# EAGLE design hddj (EAGLE 4.16)
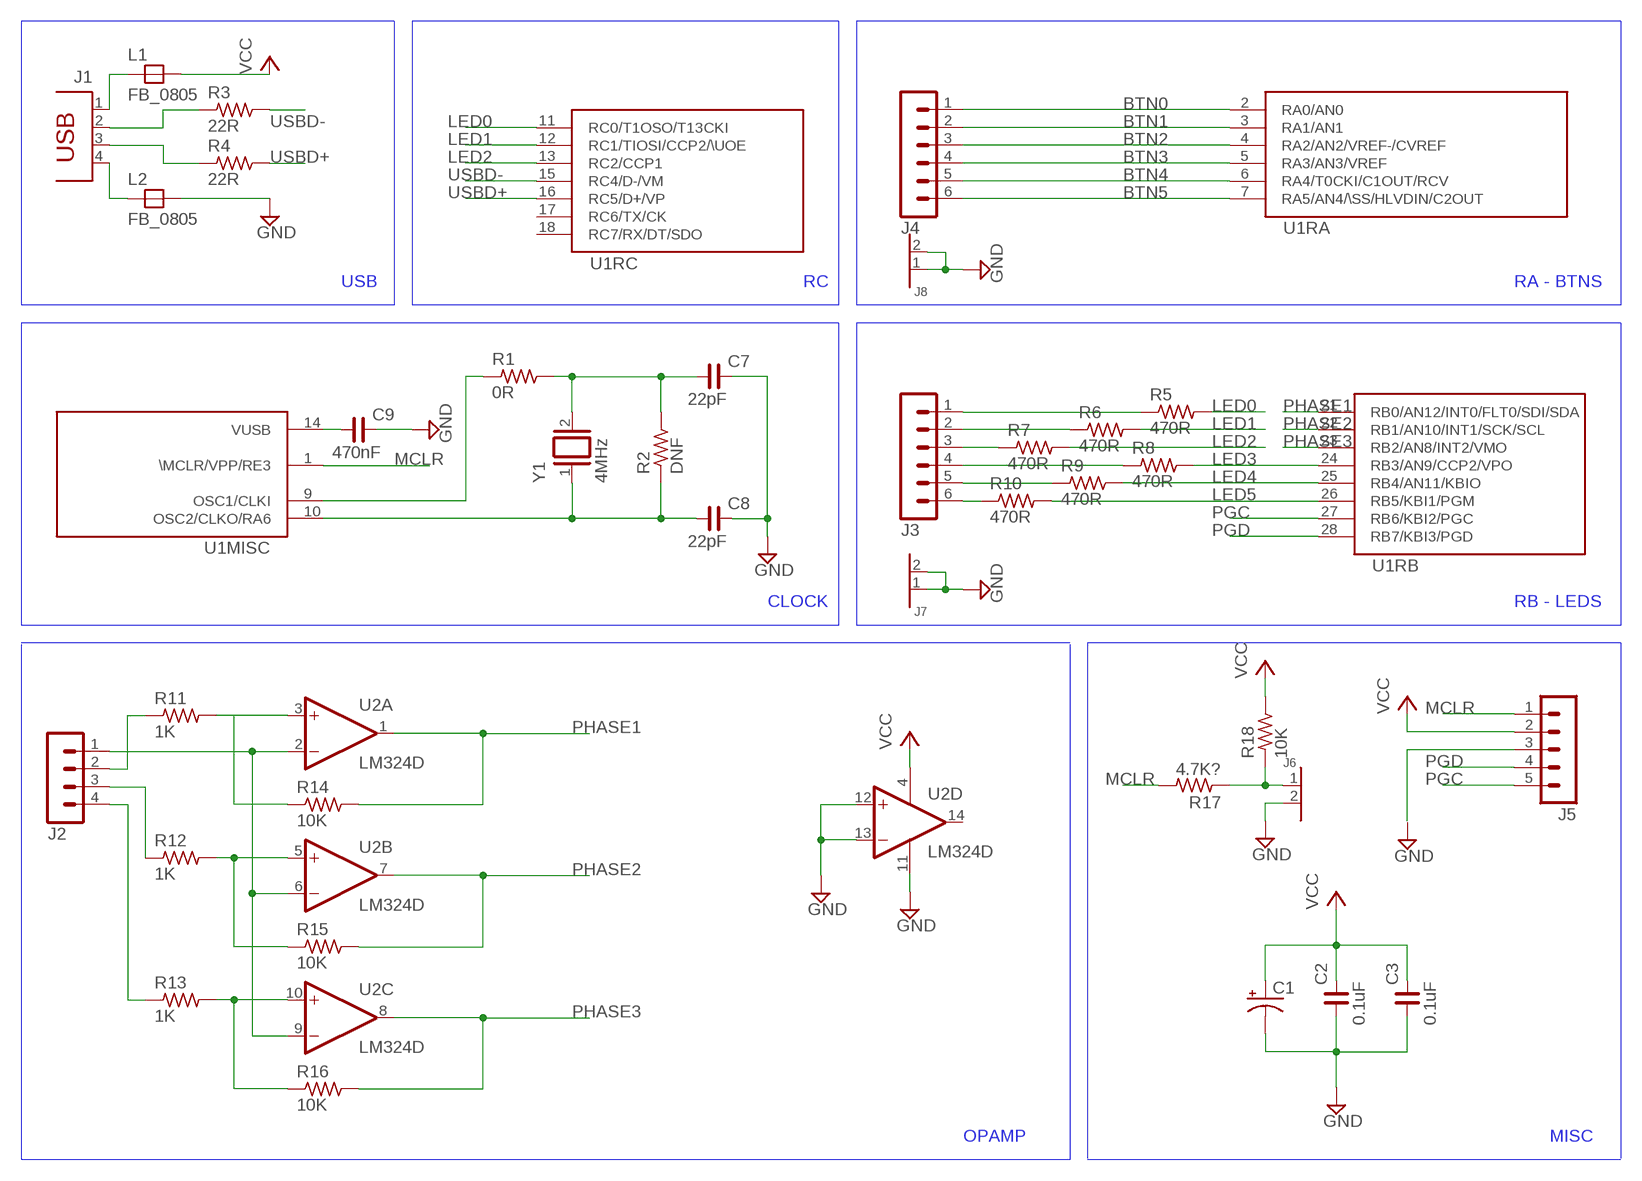
[diagram p0: schematic, sheet 1]

## Parts
C1  CPOL-USCT3216  [CT3216]
C2  0.1uF  C_0805  [C0805]
C3  0.1uF  C_0805  [C0805]
C7  22pF  C_0805  [C0805]
C8  22pF  C_0805  [C0805]
C9  470nF  C_0805  [C0805]
J1  PN61729  [PN61729]
J2  MA04-1  [MA04-1]
J3  MA06-1  [MA06-1]
J4  MA06-1  [MA06-1]
J5  MA05-1  [MA05-1]
J6  PINHDR2  [1X02]
J7  PINHDR2  [1X02]
J8  PINHDR2  [1X02]
L1  FB_0805  [L0805]
L2  FB_0805  [L0805]
R1  0R  R_0805  [R0805]
R2  DNF  R_0805  [R0805]
R3  22R  R_0805  [R0805]
R4  22R  R_0805  [R0805]
R5  470R  R_0805  [R0805]
R6  470R  R_0805  [R0805]
R7  470R  R_0805  [R0805]
R8  470R  R_0805  [R0805]
R9  470R  R_0805  [R0805]
R10  470R  R_0805  [R0805]
R11  1K  R_0805  [R0805]
R12  1K  R_0805  [R0805]
R13  1K  R_0805  [R0805]
R14  10K  R_0805  [R0805]
R15  10K  R_0805  [R0805]
R16  10K  R_0805  [R0805]
R17  4.7K?  R_0805  [R0805]
R18  10K  R_0805  [R0805]
U1  PIC18F2550SO  [SO-28W]
U2  LM324D  [SO14]
Y1  4MHz  XTAL/S  [QS]

## Nets
BTN0: J4.1 U1.2(RA:RA0/AN0)
BTN1: J4.2 U1.3(RA:RA1/AN1)
BTN2: J4.3 U1.4(RA:RA2/AN2/VREF-/CVREF)
BTN3: J4.4 U1.5(RA:RA3/AN3/VREF)
BTN4: J4.5 U1.6(RA:RA4/T0CKI/C1OUT/RCV)
BTN5: J4.6 U1.7(RA:RA5/AN4/\SS/HLVDIN/C2OUT)
GND: C1.- C2.1 C3.1 C7.2 C8.2 C9.2 J5.3 J6.2 J7.1 J7.2 J8.1 J8.2 L2.2 U2.11(P:V-) U2.12(D:+IN) U2.13(D:-IN)
LED0: R5.2 U1.11(RC:RC0/T1OSO/T13CKI)
LED1: R6.2 U1.12(RC:RC1/TIOSI/CCP2/\UOE)
LED2: R7.2 U1.13(RC:RC2/CCP1)
LED3: R8.2 U1.24(RB:RB3/AN9/CCP2/VPO)
LED4: R9.2 U1.25(RB:RB4/AN11/KBIO)
LED5: R10.2 U1.26(RB:RB5/KBI1/PGM)
MCLR: J5.1 R17.2 U1.1(MISC:\MCLR/VPP/RE3)
N$1: J3.6 R10.1
N$2: R1.1 U1.9(MISC:OSC1/CLKI)
N$3: J3.5 R9.1
N$4: J3.4 R8.1
N$5: J3.3 R7.1
N$6: J3.2 R6.1
N$7: J3.1 R5.1
N$8: J6.1 R17.1 R18.1
N$11: R13.2 R16.1 U2.10(C:+IN)
N$12: R12.2 R15.1 U2.5(B:+IN)
N$13: R11.2 R14.1 U2.3(A:+IN)
N$14: C7.1 R1.2 R2.2 Y1.2
N$15: C8.1 R2.1 U1.10(MISC:OSC2/CLKO/RA6) Y1.1
N$16: C9.1 U1.14(MISC:VUSB)
N$17: J2.1 U2.2(A:-IN) U2.6(B:-IN) U2.9(C:-IN)
N$18: J1.4 L2.1
N$19: J2.2 R11.1
N$20: J2.3 R12.1
N$21: J2.4 R13.1
N$22: J1.3 R4.1
N$29: J1.2 R3.1
N$30: J1.1 L1.1
PGC: J5.5 U1.27(RB:RB6/KBI2/PGC)
PGD: J5.4 U1.28(RB:RB7/KBI3/PGD)
PHASE1: R14.2 U1.21(RB:RB0/AN12/INT0/FLT0/SDI/SDA) U2.1(A:OUT)
PHASE2: R15.2 U1.22(RB:RB1/AN10/INT1/SCK/SCL) U2.7(B:OUT)
PHASE3: R16.2 U1.23(RB:RB2/AN8/INT2/VMO) U2.8(C:OUT)
USBD+: R4.2 U1.16(RC:RC5/D+/VP)
USBD-: R3.2 U1.15(RC:RC4/D-/VM)
VCC: C1.+ C2.2 C3.2 J5.2 L1.2 R18.2 U2.4(P:V+)
Unconnected: U1.17(RC:RC6/TX/CK) U1.18(RC:RC7/RX/DT/SDO) U2.14(D:OUT)

## Notes on the sheet
- USB | RC | RA - BTNS
- CLOCK | RB - LEDS
- OPAMP | MISC

## Power pins joined to a net without a drawn wire
GND: U1.8(GND) U1.19(GND)
VCC: U1.20(VCC)

## Library data of the parts
C1 = rcl:CPOL-US: POLARIZED CAPACITOR, American symbol
C2 C3 C7-C9 = rc-master:C_: NON-POLARIZED CAP
J1 = con-berg:PN61729: BERG USB connector
J2 = con-lstb:MA04-1: PIN HEADER
J3 J4 = con-lstb:MA06-1: PIN HEADER
J5 = con-lstb:MA05-1: PIN HEADER
J6-J8 = dongle:PINHDR2
L1 L2 = rc-master:FB_: FERRITE BEAD
R1-R18 = rc-master:R_: RESISTOR
U1 = dongle:PIC18F2550
U2 = linear:LM324: OP AMP
Y1 = special:XTAL/S: CRYSTAL

## Board
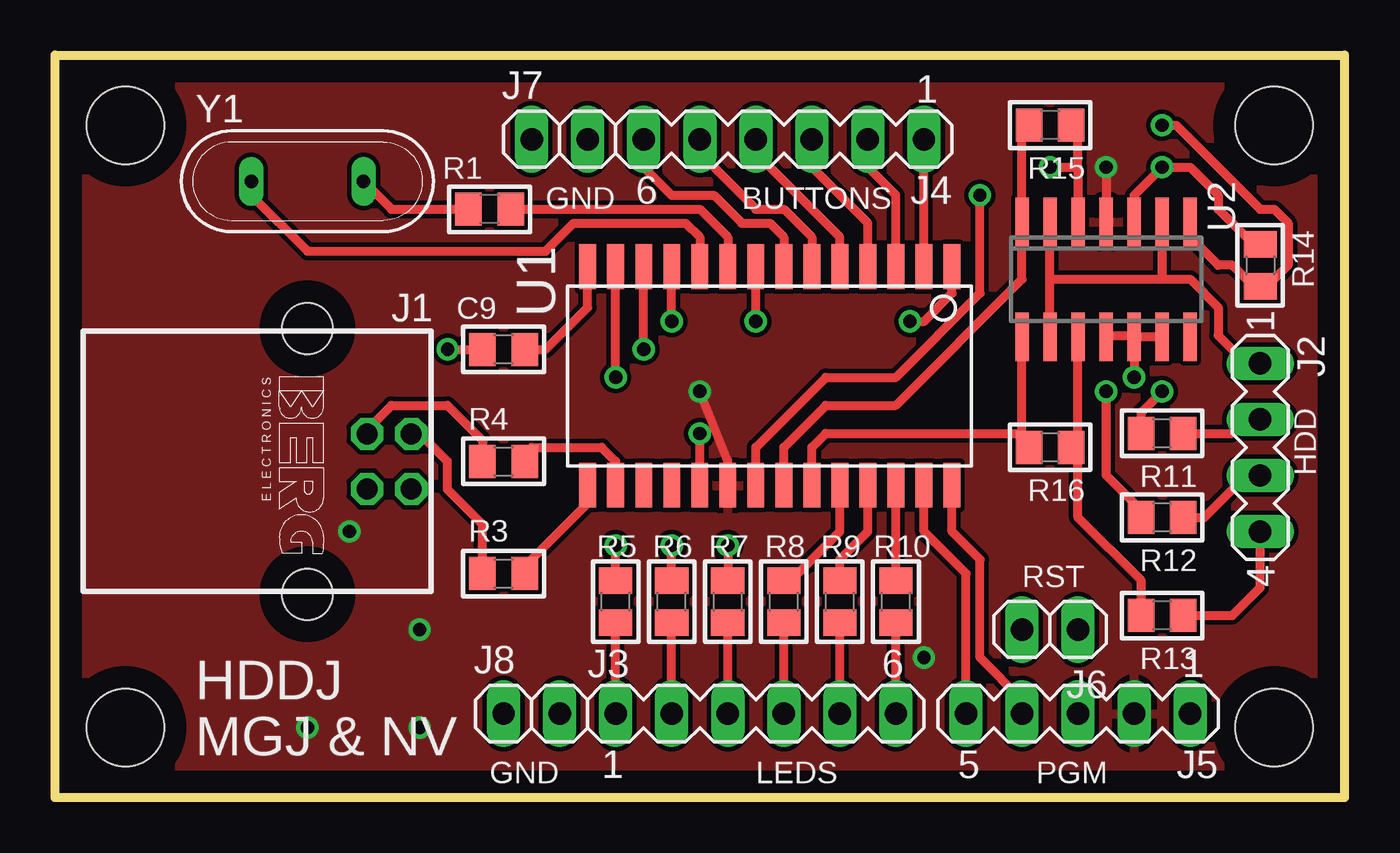
[diagram p1: board, top side]
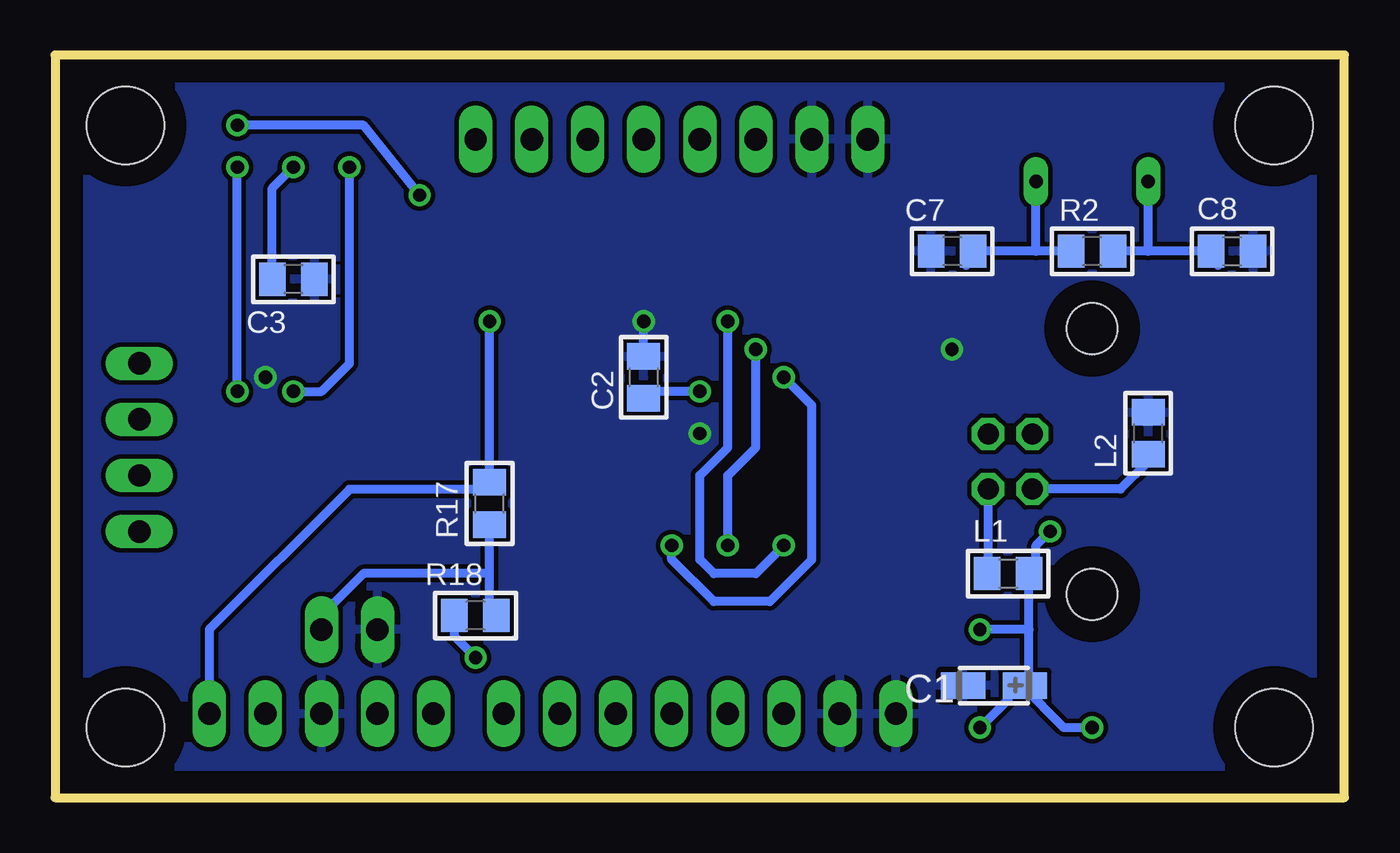
[diagram p2: board, bottom side, seen from below]

Size 58.42 x 33.66 mm. Coordinates in mm from the lower left corner, seen from the top.
Outline: 0,0 0,33.66 58.42,33.66 58.42,0 0,0
Copper layers (1*16): Top 0.035mm / dielectric 1.5mm / Bottom 0.035mm
Design rules "default": minimum track width 10mil, minimum drill 12mil, track to track 8mil, track to pad 8mil, pad to pad 8mil, via to via 8mil, smd to smd 8mil, copper to edge 40mil, drill to drill 8mil, minimum pad ring 10mil, minimum via ring 8mil, stop-mask expansion 4mil, vias tented up to drill 0mil, thermal gap 10mil
Holes 3.5 mm at 3.17,3.17 3.17,30.48 55.24,30.48 55.24,3.17

### Footprints (pad centres in the part's own frame; a part is rotated, then mirrored left to right if it is on the bottom)
CT3216 = smd 2 x 1.2: + 1.4,0; - -1.4,0
C0805 = smd 1.2 x 1.5: 1 -0.953,0; 2 0.953,0
PN61729 = drill 0.95 octagon: 1 1.25,4.71; 2 -1.25,4.71; 3 -1.25,2.71; 4 1.25,2.71 | hole 2.3: -6.02,0; 6.02,0
MA04-1 = drill 1.016 long: 1 -3.81,0; 2 -1.27,0; 3 1.27,0; 4 3.81,0
MA06-1 = drill 1.016 long: 1 -6.35,0; 2 -3.81,0; 3 -1.27,0; 4 1.27,0; 5 3.81,0; 6 6.35,0
MA05-1 = drill 1.016 long: 1 -5.08,0; 2 -2.54,0; 3 0,0; 4 2.54,0; 5 5.08,0
1X02 = drill 1.016 long: 1 -1.27,0; 2 1.27,0
L0805 = smd 1.2 x 1.5: 1 -0.953,0; 2 0.953,0
R0805 = smd 1.2 x 1.5: 1 -0.953,0; 2 0.953,0
SO-28W = smd 0.762 x 2.032: 1 -7.62,-5.016; 2 -6.35,-5.016; 3 -5.08,-5.016; 4 -3.81,-5.016; 5 -2.54,-5.016; 6 -1.27,-5.016; 7 0,-5.016; 8 1.27,-5.016; 9 2.54,-5.016; 10 3.81,-5.016; 11 5.08,-5.016; 12 6.35,-5.016; 13 7.62,-5.016; 14 8.89,-5.016; 15 8.89,4.889; 16 7.62,4.889; 17 6.35,4.889; 18 5.08,4.889; 19 3.81,4.889; 20 2.54,4.889; 21 1.27,4.889; 22 0,4.889; 23 -1.27,4.889; 24 -2.54,4.889; 25 -3.81,4.889; 26 -5.08,4.889; 27 -6.35,4.889; 28 -7.62,4.889
SO14 = smd 0.6 x 2.2: 1 -3.81,-2.6; 2 -2.54,-2.6; 3 -1.27,-2.6; 4 0,-2.6; 5 1.27,-2.6; 6 2.54,-2.6; 7 3.81,-2.6; 8 3.81,2.6; 9 2.54,2.6; 10 1.27,2.6; 11 0,2.6; 12 -1.27,2.6; 13 -2.54,2.6; 14 -3.81,2.6
QS = drill 0.61 long: 1 -2.54,0; 2 2.54,0

### Placement (x,y rotation side)
C1  15.88,5.08 0 bottom
C2  31.75,19.05 270 bottom
C3  47.62,23.5 180 bottom
C7  17.78,24.77 180 bottom
C8  5.08,24.77 0 bottom
C9  20.32,20.32 180 top
J1  11.43,15.24 270 top
J2  54.61,15.88 270 top
J3  31.75,3.81 0 top
J4  33.02,29.85 180 top
J5  46.35,3.81 180 top
J6  45.09,7.62 180 top
J7  22.86,29.85 0 top
J8  21.59,3.81 0 top
L1  15.24,10.16 0 bottom
L2  8.89,16.51 90 bottom
R1  19.69,26.67 180 top
R2  11.43,24.77 180 bottom
R3  20.32,10.16 0 top
R4  20.32,15.24 0 top
R5  25.4,8.89 90 top
R6  27.94,8.89 90 top
R7  30.48,8.89 90 top
R8  33.02,8.89 90 top
R9  35.56,8.89 90 top
R10  38.1,8.89 90 top
R11  50.16,16.51 180 top
R12  50.16,12.7 180 top
R13  50.16,8.26 180 top
R14  54.61,24.13 270 top
R15  45.09,30.48 180 top
R16  45.09,15.88 180 top
R17  38.73,13.33 90 bottom
R18  39.37,8.26 180 bottom
U1  33.02,19.05 180 top
U2  47.62,23.5 180 top
Y1  11.43,27.94 0 top

### Tracks (layer width: path | path; a pad name or v marks a point on that pad's centre or on a via)
BTN0
  Top 0.406: U1.2 J4.1
BTN1
  Top 0.406: U1.3 38.1,27.31 36.83,28.58 J4.2
BTN2
  Top 0.406: U1.4 36.83,26.04 34.29,28.58 J4.3
BTN3
  Top 0.406: U1.5 35.56,25.4 31.75,29.21 J4.4
BTN4
  Top 0.406: U1.6 34.29,25.4 33.02,26.67 31.75,26.67 29.21,29.21 J4.5
BTN5
  Top 0.406: J4.6 26.67,28.58 27.94,27.31 29.85,27.31 31.12,26.04 32.38,26.04 33.02,25.4 U1.7
GND  (via drill 0.6)
  Top 0.406: v17.78,20.32 C9.2 | v31.75,21.59 U1.8 | 48.89,20.96 U2.12 | U2.11 47.62,20.96 48.89,20.96 | U2.13 48.95,20.9 48.89,20.96 | 48.89,20.96 v48.89,19.05 | U1.19 v29.21,16.51
  Bottom 0.406: C2.1 v31.75,21.59
  pour Bottom: 0.64,32.38 0.64,0.64 57.15,0.64 57.15,32.38
LED0  (via drill 0.6)
  Top 0.406: 25.4,9.53 R5.2 v25.4,11.43 | v27.94,21.59 U1.11
  Bottom 0.406: v25.4,11.43 26.67,10.16 28.58,10.16 29.21,10.79 29.21,14.61 27.94,15.88 v27.94,21.59
LED1  (via drill 0.6)
  Top 0.406: 27.94,9.53 R6.2 v27.94,11.43 | v26.67,20.32 U1.12
  Bottom 0.406: v27.94,11.43 27.94,14.61 26.67,15.88 v26.67,20.32
LED2  (via drill 0.6)
  Top 0.406: 30.48,9.53 R7.2 v30.48,11.43 | v25.4,19.05 U1.13
  Bottom 0.406: v30.48,11.43 30.48,10.79 28.58,8.89 26.04,8.89 24.13,10.79 24.13,17.78 v25.4,19.05
LED3
  Top 0.406: U1.24 35.56,12.06 33.02,9.53 R8.2
LED4
  Top 0.406: U1.25 36.83,12.06 35.56,10.79 R9.2
LED5
  Top 0.406: R10.2 U1.26
MCLR  (via drill 0.6)
  Top 0.406: 40.64,23.5 U1.1 40.64,22.86 39.37,21.59 v38.73,21.59
  Bottom 0.406: 51.43,4.45 J5.1 | 51.43,4.45 51.43,5.08 | v38.73,21.59 R17.2 38.73,13.97 45.09,13.97 51.43,7.62 51.43,4.45
N$1
  Top 0.406: J3.6 R10.1
N$2
  Top 0.406: U1.9 30.48,25.4 29.21,26.67 R1.1
N$3
  Top 0.406: J3.5 R9.1
N$4
  Top 0.406: J3.4 R8.1
N$5
  Top 0.406: J3.3 R7.1
N$6
  Top 0.406: J3.2 R6.1
N$7
  Top 0.406: J3.1 R5.1
N$8
  Bottom 0.406: 38.73,10.16 38.73,8.26 R18.1 38.1,8.26 | 38.73,10.16 R17.1 | J6.1 46.35,8.26 44.45,10.16 38.73,10.16
N$11
  Top 0.406: 46.35,15.88 U2.10 | 46.35,15.88 R16.1 | 46.35,15.88 46.35,12.7 49.21,9.84 R13.2
N$12  (via drill 0.6)
  Top 0.406: R15.1 46.35,29.85 46.35,28.58 | R12.2 49.21,13.02 47.62,14.61 v47.62,18.42 | 46.35,28.58 U2.5 | v45.09,28.58 46.35,28.58
  Bottom 0.406: v45.09,28.58 45.09,19.69 46.35,18.42 v47.62,18.42
N$13  (via drill 0.6)
  Top 0.406: R11.2 49.21,17.46 v50.16,18.42 | U2.3 48.89,27.31 v50.16,28.58 51.43,28.58 52.7,27.31 52.7,26.67 54.29,25.08 R14.1
  Bottom 0.406: v50.16,18.42 v50.16,28.58
N$14
  Top 0.406: Y1.2 15.24,26.67 R1.2
  Bottom 0.406: 17.15,24.13 C7.1 13.97,24.77 | R2.2 13.97,24.77 | 13.97,24.77 Y1.2
N$15
  Top 0.406: U1.10 29.21,25.4 28.58,26.04 23.5,26.04 22.23,24.77 11.43,24.77 8.89,27.31 Y1.1
  Bottom 0.406: 5.71,24.13 C8.1 8.89,24.77 | 8.89,24.77 R2.1 | 8.89,24.77 Y1.1
N$16
  Top 0.406: C9.1 22.23,20.32 24.13,22.23 U1.14 24.13,24.13
N$17
  Top 0.406: 45.09,23.5 U2.6 | 45.09,23.5 50.16,23.5 | 50.16,23.5 51.43,23.5 52.7,22.23 52.7,20.96 53.98,19.69 J2.1 | U2.9 45.09,23.5 | 50.16,23.5 U2.2
N$18
  Bottom 0.406: L2.1 8.89,15.24 10.14,13.99 J1.4
N$19
  Top 0.406: J2.2 53.98,17.15 53.34,16.51 R11.1
N$20
  Top 0.406: J2.3 53.98,14.61 52.07,12.7 R12.1
N$21
  Top 0.406: J2.4 54.61,9.53 53.34,8.26 R13.1
N$22
  Top 0.406: R4.1 19.37,16.19 17.78,17.78 15.24,17.78 13.97,16.51 13.99,16.49 J1.3
N$29
  Top 0.406: R3.1 19.37,12.38 17.78,13.97 17.78,15.24 16.51,16.51 16.49,16.49 J1.2
N$30
  Bottom 0.406: L1.1 16.51,10.16 16.14,10.53 J1.1
PGC
  Top 0.406: U1.27 39.37,12.06 41.27,10.16 J5.5
PGD
  Top 0.406: U1.28 40.64,12.06 41.91,10.79 41.91,6.35 43.81,4.45 J5.4
PHASE1  (via drill 0.6)
  Top 0.406: v41.91,27.31 41.91,22.86 38.1,19.05 34.92,19.05 31.75,15.88 U1.21 | U2.1 51.43,25.4 52.7,24.13 53.34,24.13 54.61,22.86 R14.2 54.93,23.18 55.88,24.13 55.88,26.04 55.24,26.67 54.61,26.67 50.8,30.48 v50.16,30.48
  Bottom 0.406: v41.91,27.31 44.45,30.48 v50.16,30.48
PHASE2
  Top 0.406: R15.2 43.81,29.85 U2.7 43.81,23.5 38.1,17.78 34.92,17.78 33.02,15.88 U1.22
PHASE3
  Top 0.406: R16.2 43.81,15.88 43.81,16.51 | 43.81,16.51 U2.8 | U1.23 34.29,15.88 34.92,16.51 43.81,16.51
USBD+
  Top 0.406: U1.16 25.4,15.24 24.77,15.88 21.59,15.88 20.96,15.24 R4.2
USBD-
  Top 0.406: R3.2 20.96,10.16 24.13,13.33 U1.15
VCC  (via drill 0.6)
  Top 0.406: U1.20 30.48,15.24 v29.21,18.42 | v47.62,28.58 U2.4
  Bottom 0.406: C3.2 48.58,27.62 v47.62,28.58 | 14.61,5.08 C1.+ | 14.29,7.62 14.29,5.4 14.61,5.08 | 14.29,7.62 L1.2 | 14.29,7.62 v16.51,7.62 | v11.43,3.17 12.7,3.17 14.61,5.08 | 14.61,5.08 15.24,5.08 15.24,4.45 v16.51,3.17 | 13.97,10.16 13.97,11.43 v13.33,12.06 | R18.2 40.32,7.3 v39.37,6.35 | C2.2 31.75,18.42 v29.21,18.42
  pour Top: 0.64,33.02 0.64,0.64 57.15,0.64 57.15,33.02

### Text on the board
tNames: GND | BUTTONS | HDD | RST | HDDJ | MGJ & NV | GND | LEDS | PGM